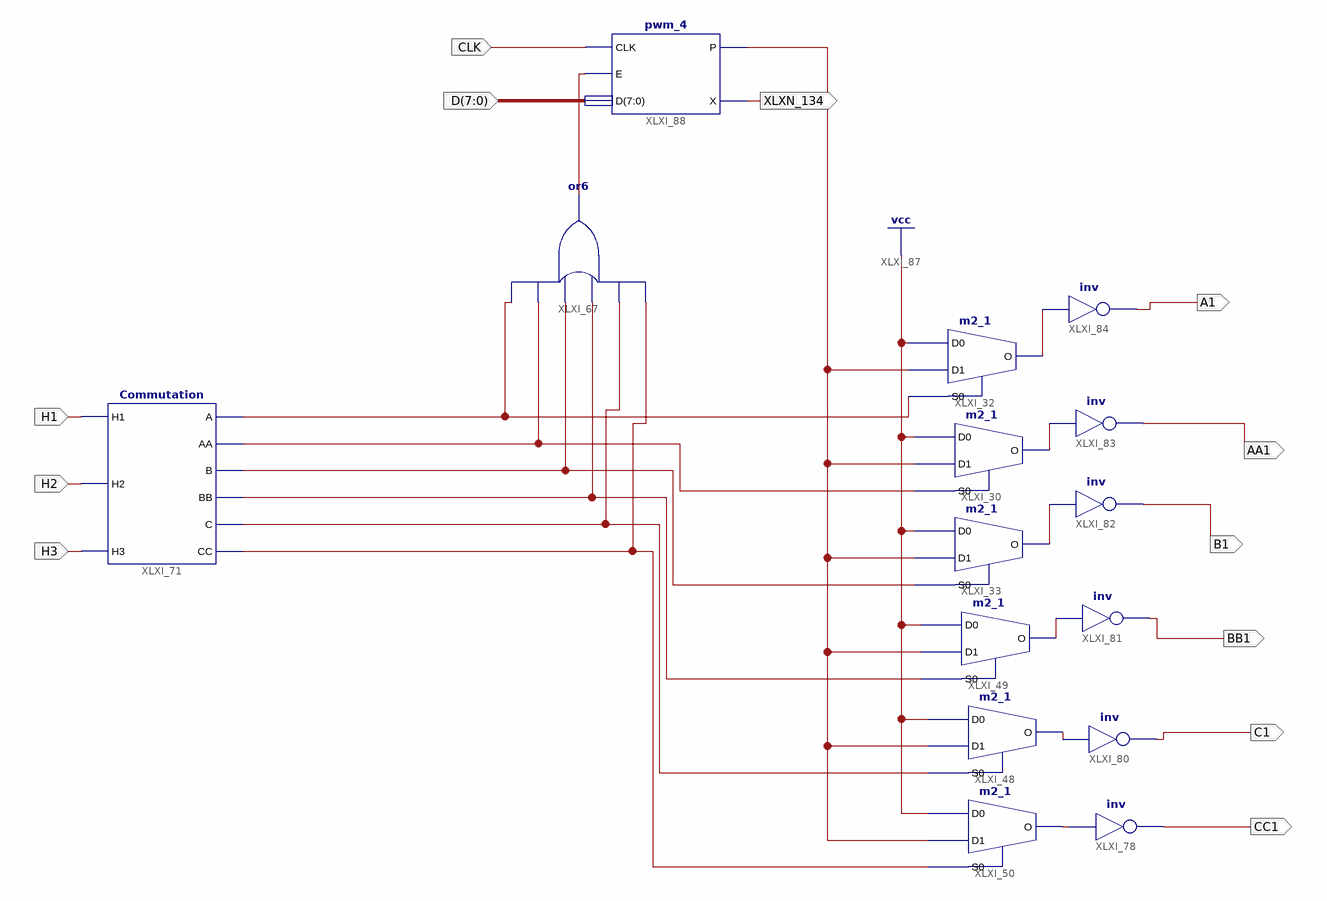
[diagram p0: schematic sheet 1]
// Xilinx ISE schematic MAIN_2.sch (spartan3e) as structural Verilog: 15 symbols, 12 ports
module MAIN_2 (
  input  H3,
  input  H2,
  input  H1,
  input  [7:0] D,
  input  CLK,
  output A1,
  output AA1,
  output B1,
  output BB1,
  output C1,
  output CC1,
  output XLXN_134
);

  wire A, AA, B, BB, C, CC, XLXN_113, XLXN_114, XLXN_115, XLXN_116, XLXN_124, XLXN_128, XLXN_130, XLXN_133;

  m2_1 XLXI_30 (.D0(1'b1), .D1(XLXN_128), .S0(XLXN_130), .O(AA));
  m2_1 XLXI_32 (.D0(1'b1), .D1(XLXN_128), .S0(XLXN_124), .O(A));
  m2_1 XLXI_33 (.D0(1'b1), .D1(XLXN_128), .S0(XLXN_113), .O(B));
  m2_1 XLXI_49 (.D0(1'b1), .D1(XLXN_128), .S0(XLXN_114), .O(BB));
  m2_1 XLXI_50 (.D0(1'b1), .D1(XLXN_128), .S0(XLXN_116), .O(CC));
  m2_1 XLXI_48 (.D0(1'b1), .D1(XLXN_128), .S0(XLXN_115), .O(C));
  or XLXI_67 (XLXN_133, XLXN_116, XLXN_115, XLXN_114, XLXN_113, XLXN_130, XLXN_124);
  Commutation XLXI_71 (
    .H1(H1), .H2(H2), .H3(H3), .C(XLXN_115), .BB(XLXN_114), .B(XLXN_113), .AA(XLXN_130), .A(XLXN_124),
    .CC(XLXN_116));
  not XLXI_78 (CC1, CC);
  not XLXI_80 (C1, C);
  not XLXI_81 (BB1, BB);
  not XLXI_82 (B1, B);
  not XLXI_83 (AA1, AA);
  not XLXI_84 (A1, A);
  pwm_4 XLXI_88 (.CLK(CLK), .E(XLXN_133), .D(D), .P(XLXN_128), .X(XLXN_134));
endmodule
